# Altium schematic sheet coils.SchDoc: Coils
size A
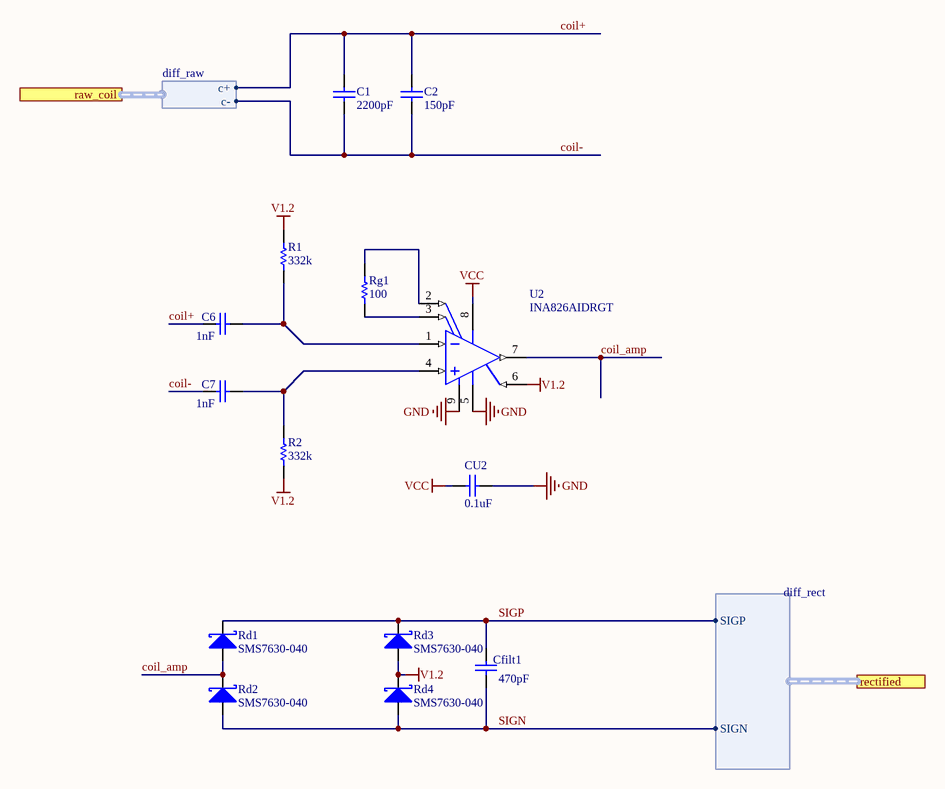
[diagram p0: coils.SchDoc]

## Parts
C1  value 2200pF  [0402]  (hidden comment: Cap)
C2  value 150pF  [0402]  (hidden comment: Cap)
C6  value 1nF  [0402]  (hidden comment: Cap)
C7  value 1nF  [0402]  (hidden comment: Cap)
Cfilt1  value 470pF  [0402]  (hidden comment: Cap)
CU2  value 0.1uF  [0402]  (hidden comment: Cap)
R1  value 332k  [0402]  (hidden comment: Res)
R2  value 332k  [0402]  (hidden comment: Res)
Rd1  SMS7630-040  [0402]
Rd2  SMS7630-040  [0402]
Rd3  SMS7630-040  [0402]
Rd4  SMS7630-040  [0402]
Rg1  value 100  [0402]  (hidden comment: Res)
U2  INA826AIDRGT  [DRG0008A_V]

## Ports
raw_coil (harness diff_raw), rectified (harness diff_rect)

## Harnesses
diff_raw: c-, c+
diff_rect: SIGN, SIGP

## Nets
GND: CU2.1 U2.5(VS-) U2.9(EP)
V1.2: R1.2 R2.1 Rd3.1(A) Rd4.2(K) U2.6(REF)
VCC: CU2.2 U2.8(VS+)
coil+: C1.2 C2.2 C6.1 ; port raw_coil.c+
coil-: C1.1 C2.1 C7.1 ; port raw_coil.c-
coil_amp: Rd1.1(A) Rd2.2(K) U2.7(VOUT)
SIGN: Cfilt1.1 Rd2.1(A) Rd4.1(A) ; port rectified.SIGN
SIGP: Cfilt1.2 Rd1.2(K) Rd3.2(K) ; port rectified.SIGP
NetC6_2: C6.2 R1.1 U2.1(IN-)
NetC7_2: C7.2 R2.2 U2.4(IN+)
NetRg1_1: Rg1.1 U2.2(RG)
NetRg1_2: Rg1.2 U2.3(RG)

## Library data of the parts
C1 C2 C6 C7 Cfilt1 CU2 = Cap: Ceramic Capacitor (Surface Mount); Manufacturer: Generic Ceramic Chip Cap (TBD)
  C2 Cfilt1 CU2: Digi-Key Part Number: *; Manufacturer Part Number: *; Note: *; Rating: *
R1 R2 Rg1 = Res: Chip Resistor (Surface Mount); Manufacturer: Generic Chip Res (TBD); Manufacturer Part Number: *; Digi-Key Part Number: *; Rating: *
U2 = CMP-0944-00099-2: Precision, 200-uA Supply Current, 36-V Supply Instrumentation Amplifier, -40 to 125 degC, 8-pin SON (DRG8), Green (RoHS & no Sb/Br); Manufacturer: Texas Instruments; Input Offset Drift (+/-)(Max)(uV/Degrees Celsius): 2; CMRR(Min)(dB): 84; Quiescent Current (+/-)(Typ)(mA): 0.2; Input Offset (+/-)(Max)(uV): 150; Output Offset Drift (+/-)(Max)(uV/Degrees Celsius): 10; Vs(Max)(V): 36; Non-Linearity (+/-)(Max)(%): 0.0005; Input Bias Current (+/-)(Max)(nA): 65; Number of Channels: 1; Noise at 1kHz(Typ)(nV/rt(Hz)): 18; SubFamily: Single Supply; Output Offset (+/-)(Max)(uV): 700; Gain(V/V): 1 to 1000; Vs(Min)(V): 2.7; PartNumber: INA826AIDRGT; PackageVersion: 4205379/C, 12/2010; DatasheetVersion: SBOS562E; Eco-Plan: Green (RoHS & no Sb/Br); Code_JEDEC: MO-229; ComponentLink2Description: Datasheet; ComponentLink3URL: http://www.ti.com/litv/pdf/mpds151b; ComponentLink2URL: http://www.ti.com/general/docs/lit/getliterature.tsp?genericPartNumber=INA826&fileType=pdf; Mounting Technology: Surface Mount; PackageReference: DRG0008A; PackageDescription: 8-Pin Plastic Small Outline, Body 3 x 3 mm, Pitch 0.5 mm; ComponentLink1Description: Manufacturer URL; ComponentLink1URL: http://www.ti.com/; ComponentLink3Description: Package Specification